# Altium schematic sheet [03] - CONNECTORS.SchDoc
size A2; DocumentNumber: 3; SheetNumber: 3; SheetTotal: 20
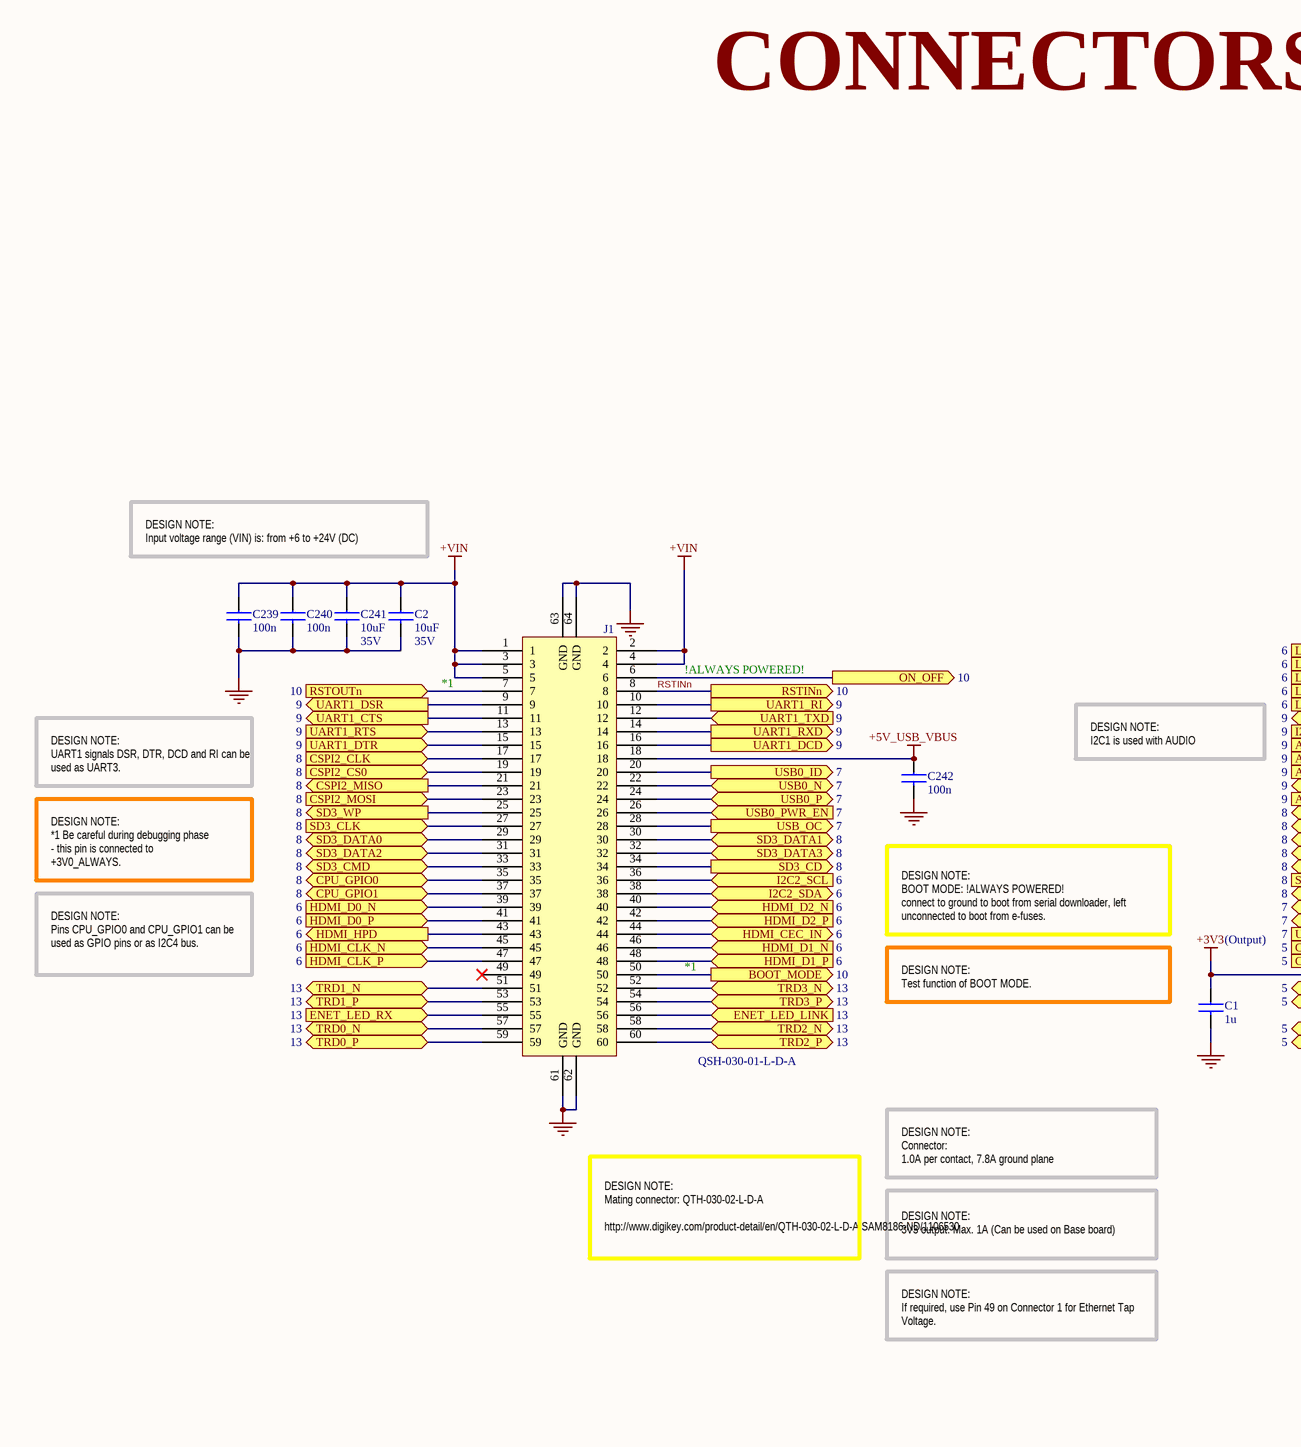
[diagram p0: [03] - CONNECTORS.SchDoc, left]
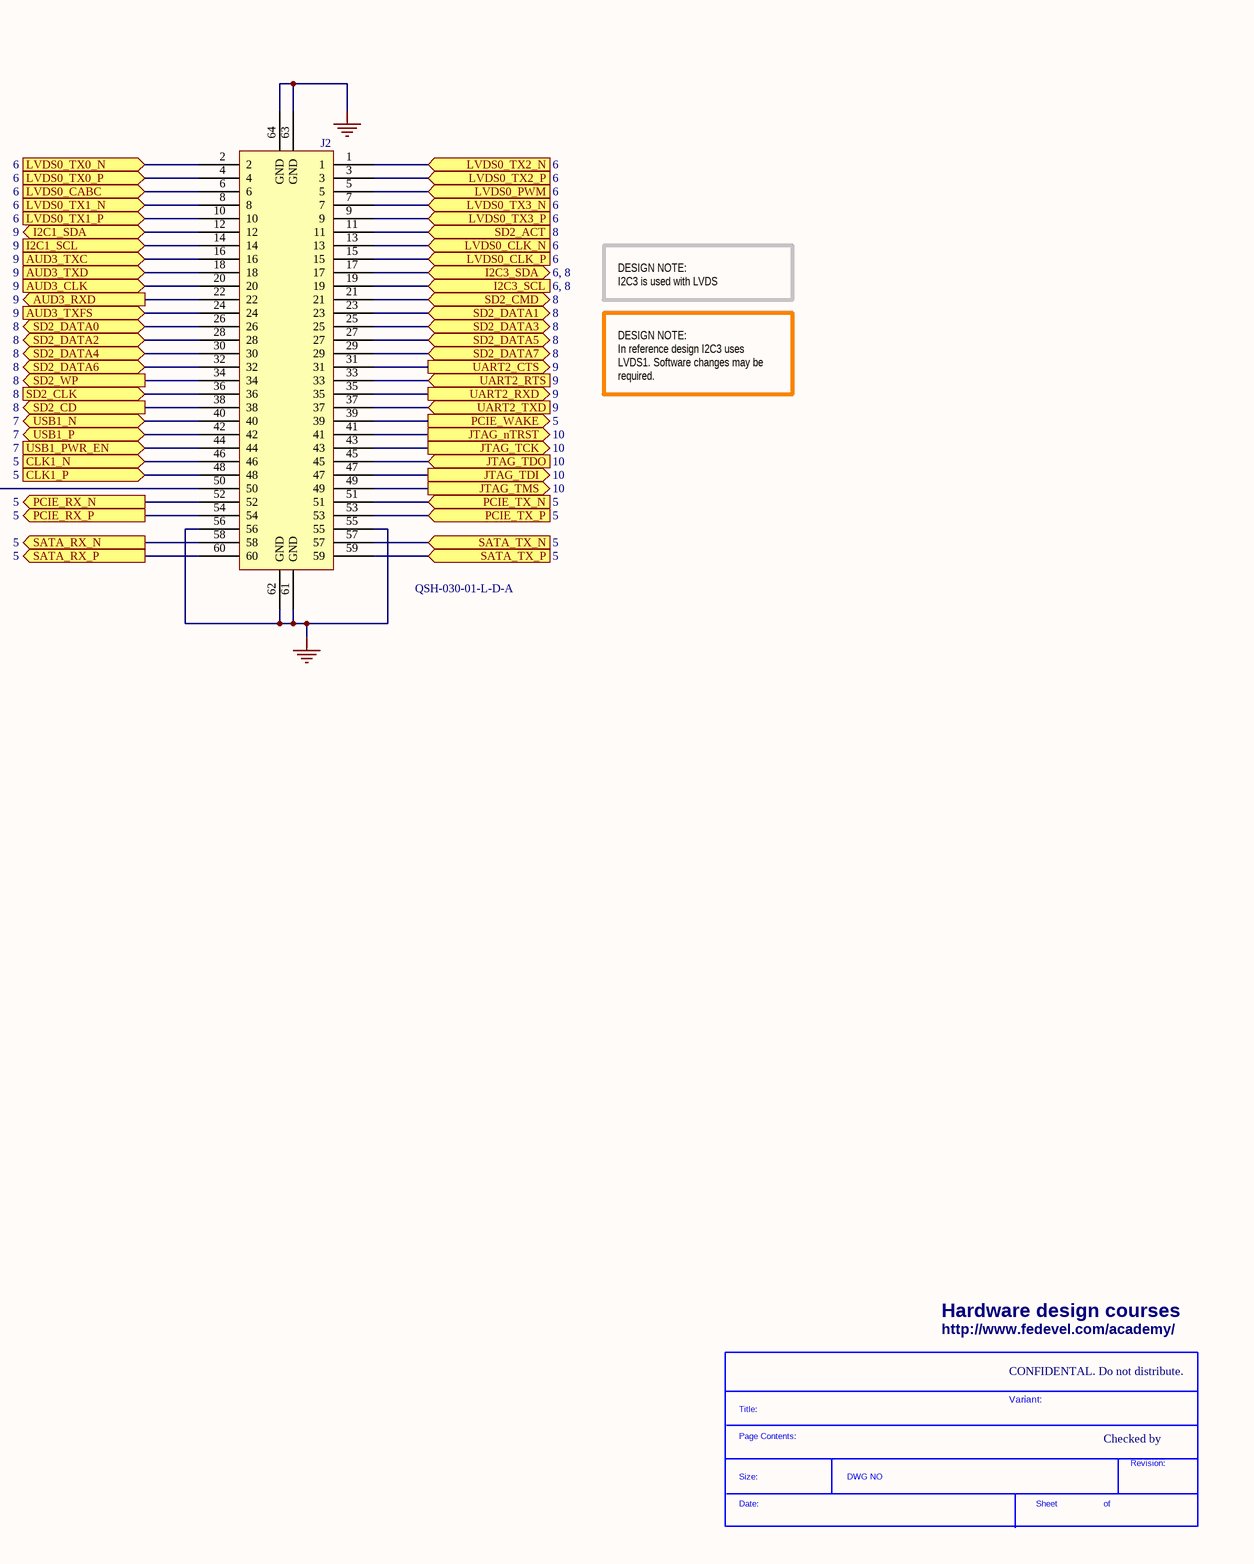
[diagram p1: [03] - CONNECTORS.SchDoc, right]

## Parts
*  SDTitleBlock  (value not drawn)  (graphical)
C1  1u  [C0402]
C2  10uF  Voltage - Rated: 35V  [C1206]
C239  100n  [C0402]
C240  100n  [C0402]
C241  10uF  Voltage - Rated: 35V  [C1206]
C242  100n  [C0402]
J1  QSH-030-01-L-D-A  [QSH-030-01-L-D-A]
J2  QSH-030-01-L-D-A  [QSH-030-01-L-D-A]

## Ports
AUD3_CLK (in, see 9), AUD3_RXD (out, see 9), AUD3_TXC (in, see 9), AUD3_TXD (in, see 9), AUD3_TXFS (in, see 9), BOOT_MODE (out, see 10), CLK1_N (in, see 5), CLK1_P (in, see 5), CPU_GPIO0 (bidir, see 8), CPU_GPIO1 (bidir, see 8), CSPI2_CLK (in, see 8), CSPI2_CS0 (in, see 8), CSPI2_MISO (out, see 8), CSPI2_MOSI (in, see 8), ENET_LED_LINK (in, see 13), ENET_LED_RX (in, see 13), HDMI_CEC_IN (bidir, see 6), HDMI_CLK_N (in, see 6), HDMI_CLK_P (in, see 6), HDMI_D0_N (in, see 6), HDMI_D0_P (in, see 6), HDMI_D1_N (in, see 6), HDMI_D1_P (in, see 6), HDMI_D2_N (in, see 6), HDMI_D2_P (in, see 6), HDMI_HPD (out, see 6), I2C1_SCL (in, see 9), I2C1_SDA (bidir, see 9), I2C2_SCL (in, see 6), I2C2_SDA (bidir, see 6), I2C3_SCL (see 6, 8), I2C3_SDA (bidir, see 6, 8), JTAG_nTRST (out, see 10), JTAG_TCK (out, see 10), JTAG_TDI (out, see 10), JTAG_TDO (in, see 10), JTAG_TMS (out, see 10), LVDS0_CABC (in, see 6), LVDS0_CLK_N (in, see 6), LVDS0_CLK_P (in, see 6), LVDS0_PWM (in, see 6), LVDS0_TX0_N (in, see 6), LVDS0_TX0_P (in, see 6), LVDS0_TX1_N (in, see 6), LVDS0_TX1_P (in, see 6), LVDS0_TX2_N (in, see 6), LVDS0_TX2_P (in, see 6), LVDS0_TX3_N (in, see 6), LVDS0_TX3_P (in, see 6), ON_OFF (see 10), PCIE_RX_N (out, see 5), PCIE_RX_P (out, see 5), PCIE_TX_N (in, see 5), PCIE_TX_P (in, see 5), PCIE_WAKE (out, see 5), RSTINn (out, see 10), RSTOUTn (see 10), SATA_RX_N (out, see 5), SATA_RX_P (out, see 5), SATA_TX_N (in, see 5), SATA_TX_P (in, see 5), SD2_ACT (in, see 8), SD2_CD (out, see 8), SD2_CLK (in, see 8), SD2_CMD (bidir, see 8), SD2_DATA0 (bidir, see 8), SD2_DATA1 (bidir, see 8), SD2_DATA2 (bidir, see 8), SD2_DATA3 (bidir, see 8), SD2_DATA4 (bidir, see 8), SD2_DATA5 (bidir, see 8), SD2_DATA6 (bidir, see 8), SD2_DATA7 (bidir, see 8), SD2_WP (out, see 8), SD3_CD (out, see 8), SD3_CLK (in, see 8), SD3_CMD (bidir, see 8), SD3_DATA0 (bidir, see 8), SD3_DATA1 (bidir, see 8), SD3_DATA2 (bidir, see 8), SD3_DATA3 (bidir, see 8), SD3_WP (out, see 8), TRD0_N (bidir, see 13), TRD0_P (bidir, see 13), TRD1_N (bidir, see 13), TRD1_P (bidir, see 13), TRD2_N (bidir, see 13), TRD2_P (bidir, see 13), TRD3_N (bidir, see 13), TRD3_P (bidir, see 13), UART1_CTS (out, see 9), UART1_DCD (out, see 9), UART1_DSR (out, see 9), UART1_DTR (in, see 9), UART1_RI (out, see 9), UART1_RTS (in, see 9), UART1_RXD (out, see 9), UART1_TXD (in, see 9), UART2_CTS (out, see 9), UART2_RTS (in, see 9), UART2_RXD (out, see 9), UART2_TXD (in, see 9), USB0_ID (out, see 7), USB0_N (bidir, see 7), USB0_P (bidir, see 7), USB0_PWR_EN (in, see 7), USB1_N (bidir, see 7), USB1_P (bidir, see 7), USB1_PWR_EN (in, see 7), USB_OC (out, see 7)

## Nets
+3V3: C1.1 J2.50
+5V_USB_VBUS: C242.1 J1.18
+VIN: C2.1 C239.1 C240.1 C241.1 J1.1 J1.2 J1.3 J1.4 J1.5
GND: C1.2 C2.2 C239.2 C240.2 C241.2 C242.2 J1.61(GND) J1.62(GND) J1.63(GND) J1.64(GND) J2.55 J2.56 J2.61(GND) J2.62(GND) J2.63(GND) J2.64(GND)
AUD3_CLK: J2.20 ; port AUD3_CLK
AUD3_RXD: J2.22 ; port AUD3_RXD
AUD3_TXC: J2.16 ; port AUD3_TXC
AUD3_TXD: J2.18 ; port AUD3_TXD
AUD3_TXFS: J2.24 ; port AUD3_TXFS
BOOT_MODE: J1.50 ; port BOOT_MODE
CLK1_N: J2.46 ; port CLK1_N
CLK1_P: J2.48 ; port CLK1_P
CPU_GPIO0: J1.35 ; port CPU_GPIO0
CPU_GPIO1: J1.37 ; port CPU_GPIO1
CSPI2_CLK: J1.17 ; port CSPI2_CLK
CSPI2_CS0: J1.19 ; port CSPI2_CS0
CSPI2_MISO: J1.21 ; port CSPI2_MISO
CSPI2_MOSI: J1.23 ; port CSPI2_MOSI
ENET_LED_LINK: J1.56 ; port ENET_LED_LINK
ENET_LED_RX: J1.55 ; port ENET_LED_RX
HDMI_CEC_IN: J1.44 ; port HDMI_CEC_IN
HDMI_CLK_N: J1.45 ; port HDMI_CLK_N
HDMI_CLK_P: J1.47 ; port HDMI_CLK_P
HDMI_D0_N: J1.39 ; port HDMI_D0_N
HDMI_D0_P: J1.41 ; port HDMI_D0_P
HDMI_D1_N: J1.46 ; port HDMI_D1_N
HDMI_D1_P: J1.48 ; port HDMI_D1_P
HDMI_D2_N: J1.40 ; port HDMI_D2_N
HDMI_D2_P: J1.42 ; port HDMI_D2_P
HDMI_HPD: J1.43 ; port HDMI_HPD
I2C1_SCL: J2.14 ; port I2C1_SCL
I2C1_SDA: J2.12 ; port I2C1_SDA
I2C2_SCL: J1.36 ; port I2C2_SCL
I2C2_SDA: J1.38 ; port I2C2_SDA
I2C3_SCL: J2.19 ; port I2C3_SCL
I2C3_SDA: J2.17 ; port I2C3_SDA
JTAG_nTRST: J2.41 ; port JTAG_nTRST
JTAG_TCK: J2.43 ; port JTAG_TCK
JTAG_TDI: J2.47 ; port JTAG_TDI
JTAG_TDO: J2.45 ; port JTAG_TDO
JTAG_TMS: J2.49 ; port JTAG_TMS
LVDS0_CABC: J2.6 ; port LVDS0_CABC
LVDS0_CLK_N: J2.13 ; port LVDS0_CLK_N
LVDS0_CLK_P: J2.15 ; port LVDS0_CLK_P
LVDS0_PWM: J2.5 ; port LVDS0_PWM
LVDS0_TX0_N: J2.2 ; port LVDS0_TX0_N
LVDS0_TX0_P: J2.4 ; port LVDS0_TX0_P
LVDS0_TX1_N: J2.8 ; port LVDS0_TX1_N
LVDS0_TX1_P: J2.10 ; port LVDS0_TX1_P
LVDS0_TX2_N: J2.1 ; port LVDS0_TX2_N
LVDS0_TX2_P: J2.3 ; port LVDS0_TX2_P
LVDS0_TX3_N: J2.7 ; port LVDS0_TX3_N
LVDS0_TX3_P: J2.9 ; port LVDS0_TX3_P
ON_OFF: J1.6 ; port ON_OFF
PCIE_RX_N: J2.52 ; port PCIE_RX_N
PCIE_RX_P: J2.54 ; port PCIE_RX_P
PCIE_TX_N: J2.51 ; port PCIE_TX_N
PCIE_TX_P: J2.53 ; port PCIE_TX_P
PCIE_WAKE: J2.39 ; port PCIE_WAKE
RSTINn: J1.8 ; port RSTINn
RSTOUTn: J1.7 ; port RSTOUTn
SATA_RX_N: J2.58 ; port SATA_RX_N
SATA_RX_P: J2.60 ; port SATA_RX_P
SATA_TX_N: J2.57 ; port SATA_TX_N
SATA_TX_P: J2.59 ; port SATA_TX_P
SD2_ACT: J2.11 ; port SD2_ACT
SD2_CD: J2.38 ; port SD2_CD
SD2_CLK: J2.36 ; port SD2_CLK
SD2_CMD: J2.21 ; port SD2_CMD
SD2_DATA0: J2.26 ; port SD2_DATA0
SD2_DATA1: J2.23 ; port SD2_DATA1
SD2_DATA2: J2.28 ; port SD2_DATA2
SD2_DATA3: J2.25 ; port SD2_DATA3
SD2_DATA4: J2.30 ; port SD2_DATA4
SD2_DATA5: J2.27 ; port SD2_DATA5
SD2_DATA6: J2.32 ; port SD2_DATA6
SD2_DATA7: J2.29 ; port SD2_DATA7
SD2_WP: J2.34 ; port SD2_WP
SD3_CD: J1.34 ; port SD3_CD
SD3_CLK: J1.27 ; port SD3_CLK
SD3_CMD: J1.33 ; port SD3_CMD
SD3_DATA0: J1.29 ; port SD3_DATA0
SD3_DATA1: J1.30 ; port SD3_DATA1
SD3_DATA2: J1.31 ; port SD3_DATA2
SD3_DATA3: J1.32 ; port SD3_DATA3
SD3_WP: J1.25 ; port SD3_WP
TRD0_N: J1.57 ; port TRD0_N
TRD0_P: J1.59 ; port TRD0_P
TRD1_N: J1.51 ; port TRD1_N
TRD1_P: J1.53 ; port TRD1_P
TRD2_N: J1.58 ; port TRD2_N
TRD2_P: J1.60 ; port TRD2_P
TRD3_N: J1.52 ; port TRD3_N
TRD3_P: J1.54 ; port TRD3_P
UART1_CTS: J1.11 ; port UART1_CTS
UART1_DCD: J1.16 ; port UART1_DCD
UART1_DSR: J1.9 ; port UART1_DSR
UART1_DTR: J1.15 ; port UART1_DTR
UART1_RI: J1.10 ; port UART1_RI
UART1_RTS: J1.13 ; port UART1_RTS
UART1_RXD: J1.14 ; port UART1_RXD
UART1_TXD: J1.12 ; port UART1_TXD
UART2_CTS: J2.31 ; port UART2_CTS
UART2_RTS: J2.33 ; port UART2_RTS
UART2_RXD: J2.35 ; port UART2_RXD
UART2_TXD: J2.37 ; port UART2_TXD
USB0_ID: J1.20 ; port USB0_ID
USB0_N: J1.22 ; port USB0_N
USB0_P: J1.24 ; port USB0_P
USB0_PWR_EN: J1.26 ; port USB0_PWR_EN
USB1_N: J2.40 ; port USB1_N
USB1_P: J2.42 ; port USB1_P
USB1_PWR_EN: J2.44 ; port USB1_PWR_EN
USB_OC: J1.28 ; port USB_OC

Not connected (* = marked no-connect by the designer): J1 49* 65(HOLE1) 66(HOLE2); J2 65(HOLE1) 66(HOLE2)

## Notes on the sheet
- CONNECTORS
- DESIGN NOTE:
  Input voltage range (VIN) is: from +6 to +24V (DC)
- *1
- !ALWAYS POWERED!
- DESIGN NOTE:
  UART1 signals DSR, DTR, DCD and RI can be used as UART3.
- DESIGN NOTE:
  I2C1 is used with AUDIO
- DESIGN NOTE:
  I2C3 is used with LVDS
- DESIGN NOTE:
  *1 Be careful during debugging phase - this pin is connected to +3V0_ALWAYS.
- DESIGN NOTE:
  In reference design I2C3 uses LVDS1. Software changes may be required.
- DESIGN NOTE:
  BOOT MODE: !ALWAYS POWERED!
  connect to ground to boot from serial downloader, left unconnected to boot from e-fuses.
- DESIGN NOTE:
  Pins CPU_GPIO0 and CPU_GPIO1 can be used as GPIO pins or as I2C4 bus.
- (Output)
- DESIGN NOTE:
  Test function of BOOT MODE.
- DESIGN NOTE:
  Connector:
  1.0A per contact, 7.8A ground plane
- DESIGN NOTE:
  Mating connector: QTH-030-02-L-D-A
  http://www.digikey.com/product-detail/en/QTH-030-02-L-D-A/SAM8186-ND/1106530
- DESIGN NOTE:
  3V3 output. Max. 1A (Can be used on Base board)
- DESIGN NOTE:
  If required, use Pin 49 on Connector 1 for Ethernet Tap Voltage.
- Hardware design courses
- http://www.fedevel.com/academy/
- CONFIDENTAL. Do not distribute.
- Variant:
- Checked by
- (in symbol SDTitleBlock) Title:; Page Contents:; Revision:; Size:; DWG NO; Date:; Sheet; of

## Library data of the parts
C1 = C1005X5R1C105K: CAP CER 1.0UF 16V X5R 0402; Manufacturer: TDK Corporation; Capacitance: 1.0µF; Value: 1uF; .Checked PCB: used; Description: CAP CER 1UF 16V 10% X5R 0402; Tolerance: ±10%; Category: Capacitors; Manufacturer Part Number: C1005X5R1C105K; Operating Temperature: -55°C ~ 85°C; Package / Case: 0402 (1005 Metric); Price 1k [$]: 0.02080; .Checked SCH: used; Voltage - Rated: 16V; Supplier Part Number: 445-4978-1-ND; Supplier: Digikey; Supplier 1: Digi-Key; Supplier Part Number 1: 445-4978-1-ND; RoHS: RoHS Compliant; Stock 1: 341010; Pricing 1: 1=0.24, 10=0.16, 100=0.064, 250=0.046, 500=0.0328, 1000=0.024 (USD); Temperature Coefficient: X5R; Mounting Type: Surface Mount, MLCC; Applications: General Purpose; Ratings: -; Size / Dimension: 0.039" L x 0.020" W (1.00mm x 0.50mm); Height - Seated (Max): -; Thickness (Max): 0.022" (0.55mm); Lead Spacing: -; Features: -; Packaging: Cut Tape (CT); Lead Style: -; ComponentLink1URL: http://www.tdk.co.jp/tefe02/e412_c.pdf; ComponentLink1Description: http://www.tdk.co.jp/tefe02/e412_c.pdf
C2 C241 = GRM31CR6YA106KA12L: CAP CER 10UF 35V X5R 1206; Manufacturer: Murata Electronics North America; Capacitance: 10µF; .Checked PCB: used; Description: CAP CER 10UF 35V 10% X5R 1206; Tolerance: ±10%; Category: Capacitors; Manufacturer Part Number: GRM31CR6YA106KA12L; Operating Temperature: -55°C ~ 85°C; Package / Case: 1206 (3216 Metric); Price 1k [$]: 0.19448; Value: 10uF; .Checked SCH: used; Supplier Part Number: 490-5524-1-ND; Supplier: Digikey; Supplier 1: Digi-Key; Supplier Part Number 1: 490-5524-1-ND; RoHS: RoHS Compliant; Stock 1: 76334; Pricing 1: 1=0.6, 10=0.501, 50=0.359, 100=0.3142, 250=0.24684, 500=0.2244, 1000=0.17952 (USD); Temperature Coefficient: X5R; Mounting Type: Surface Mount, MLCC; Applications: General Purpose; Ratings: -; Size / Dimension: 0.126" L x 0.063" W (3.20mm x 1.60mm); Height - Seated (Max): -; Thickness (Max): 0.071" (1.80mm); Lead Spacing: -; Features: -; Packaging: Cut Tape (CT); Lead Style: -; ComponentLink1URL: http://www.murata.com/products/catalog/pdf/c02e.pdf; ComponentLink1Description: http://www.murata.com/products/catalog/pdf/c02e.pdf
C239 C240 C242 = C1005X5R1H104K: CAP CER .10UF 50V X5R 10% 0402; Manufacturer: TDK Corporation; Capacitance: 0.1µF; Value: 100nF; .Checked PCB: used; Description: CAP CER 0.1UF 50V 10% X5R 0402; Category: Capacitors; Supplier Part Number: 445-5942-1-ND; Manufacturer Part Number: C1005X5R1H104K; Operating Temperature: -55°C ~ 85°C; Package / Case: 0402 (1005 Metric); Price 1k [$]: 0.02340; .Checked SCH: used; Voltage - Rated: 50V; Supplier: Digikey; Supplier 1: Digi-Key; Supplier Part Number 1: 445-5942-1-ND; RoHS: RoHS Compliant; Stock 1: 106926; Pricing 1: 1=0.27, 10=0.18, 100=0.072, 250=0.05176, 500=0.0369, 1000=0.027 (USD); Tolerance: ±10%; Temperature Coefficient: X5R; Mounting Type: Surface Mount, MLCC; Applications: General Purpose; Ratings: -; Size / Dimension: 0.039" L x 0.020" W (1.00mm x 0.50mm); Height - Seated (Max): -; Thickness (Max): 0.022" (0.55mm); Lead Spacing: -; Features: -; Packaging: Cut Tape (CT); Lead Style: -; ComponentLink1URL: http://www.tdk.co.jp/tefe02/e412_c.pdf; ComponentLink1Description: http://www.tdk.co.jp/tefe02/e412_c.pdf
J1 J2 = QSH-030-01-L-D-A: CONN RCPT HI-SPD .5MM 60POS DL; Manufacturer: Samtec Inc; .Checked PCB: used; Connector Type: Receptacle, Center Strip Contacts; Number of Positions: 60; Pitch: 0.020" (0.50mm); Mating connector: QTH-030-02-L-D-A; Mated Stacking Heights: 5mm, 8mm, 11mm, 16mm, 19mm, 25mm; .Checked SCH: used; Category: Connectors, Interconnects; Manufacturer Part Number: QSH-030-01-L-D-A; Price 1k [$]: 5.18075; Value: QSH-030-01-L-D-A; Number of Rows: 2; Height with mainting: 5mm, 8mm, 11mm, 16mm, 19mm, 25mm; Supplier Part Number: SAM8180-ND; Supplier: Digikey; Supplier 1: Digi-Key; Supplier Part Number 1: SAM8180-ND; RoHS: RoHS Compliant; Stock 1: 3746; Pricing 1: 1=8.96, 10=8.288, 25=7.84, 50=7.4368, 100=6.944, 250=6.048, 500=5.824, 1000=5.6, 2500=5.376 (USD); Mounting Type: Surface Mount; Features: Board Guide, Ground Bus (Plane); Contact Finish: Gold; Contact Finish Thickness: 10µin (0.25µm); Packaging: Tray; Height Above Board: 0.128" (3.25mm); ComponentLink1URL: http://www.samtec.com/ftppub/cpdf/QSH-XXX-01-X-D-XX-MKT.pdf; ComponentLink1Description: http://www.samtec.com/ftppub/cpdf/QSH-XXX-01-X-D-XX-MKT.pdf